# EAGLE design frog (EAGLE 7.5.0)
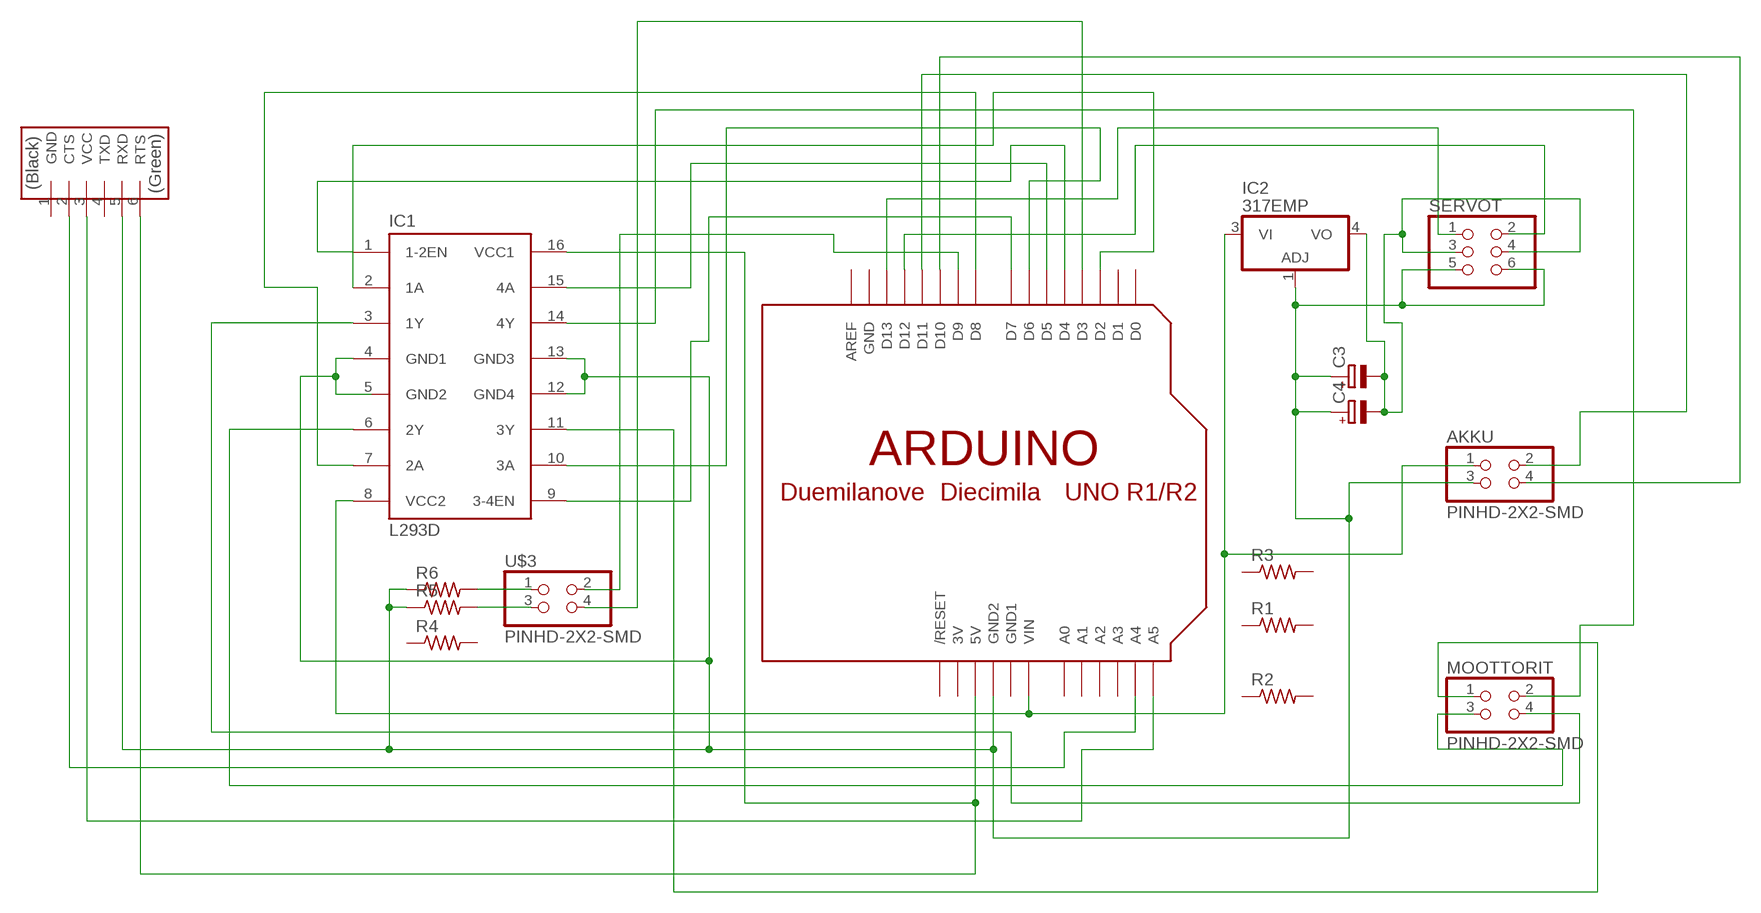
[diagram p0: schematic, sheet 1]

## Parts
AKKU  PINHD-2X2-SMD  [2X02SMD]
C3  CPOL-EUE/7260-38W  [E/7260-38W]
C4  CPOL-EUE/7260-38W  [E/7260-38W]
IC1  L293D  [DIL16]
IC2  317EMP  [SOT223]
MOOTTORIT  PINHD-2X2-SMD  [2X02SMD]
R1  RES-US1206FAB  [R1206FAB]
R2  RES-US1206FAB  [R1206FAB]
R3  RES-US1206FAB  [R1206FAB]
R4  RES-US1206FAB  [R1206FAB]
R5  RES-US1206FAB  [R1206FAB]
R6  RES-US1206FAB  [R1206FAB]
SERVOT  PINHD-2X3-SMD  [2X03SMD]
U$1  ARDUINOUNO  [ARDUINO]
U$2  FTDI-SMD-HEADER  [1X06SMD]
U$3  PINHD-2X2-SMD  [2X02SMD]

## Nets
N$1: IC1.1(1-2EN) U$1.D4
N$2: IC1.2(1A) U$1.D2
N$3: IC1.3(1Y) MOOTTORIT.4
N$4: IC1.6(2Y) MOOTTORIT.3
N$5: IC1.7(2A) U$1.D8
N$6: IC1.14(4Y) MOOTTORIT.2
N$7: AKKU.1 IC1.8(VCC2) IC2.3(VI) U$1.VIN
N$8: IC1.16(VCC1) U$1.5V U$2.6(RTS)
N$9: IC1.15(4A) U$1.D5
N$11: IC1.10(3A) U$1.D6
N$12: C3.- C4.- IC2.4(VO) SERVOT.3 SERVOT.4
N$14: IC1.9(3-4EN) U$1.D7
N$15: AKKU.4 U$1.D10
N$16: U$1.A5 U$2.3(VCC)
N$17: U$1.A4 U$2.2(CTS)
N$18: SERVOT.1 U$1.D13
N$19: SERVOT.2 U$1.D12
N$20: AKKU.2 U$1.D11
N$21: AKKU.3 C3.+ C4.+ IC1.4(GND1) IC1.12(GND4) IC1.13(GND3) IC2.1(ADJ) R5.1 R6.1 SERVOT.5 SERVOT.6 U$1.GND2 U$2.5(RXD)
N$25: IC1.11(3Y) MOOTTORIT.1
N$65: R5.2 U$3.3
N$69: R6.2 U$3.1
N$70: U$1.D9 U$3.2
N$71: U$1.D3 U$3.4
Unconnected: R1.1 R1.2 R2.1 R2.2 R3.1 R3.2 R4.1 R4.2 U$1.A0 U$1.A1 U$1.A2 U$1.A3 U$1.AREF U$1.D0 U$1.D1 U$1.RESET(/RESET) U$2.1(GND) U$2.4(TXD)

## Power pins joined to a net without a drawn wire
3V: U$1.3V
GND: U$1.GND
GND1: U$1.GND1
GND2: IC1.5(GND2)

## Library data of the parts
AKKU MOOTTORIT U$3 = fab:PINHD-2X2-SMD
C3 C4 = rcl:CPOL-EU: POLARIZED CAPACITOR, European symbol
IC1 = st-microelectronics:L293D: PUSH-PULL 4 CHANNEL DRIVER; MPN: L293D; OC_FARNELL: 9589619; OC_NEWARK: 56P8249
IC2 = linear:*317: Positive VOLTAGE REGULATOR
R1-R6 = fab:RES-US: Resistor (US Symbol) Variants with postfix FAB are widened to allow the routing of internal traces
SERVOT = fab:PINHD-2X3-SMD: PIN HEADER
U$1 = adafruit:ARDUINO: Arduino Diecimila/Duemilanove Make a shield with ease, this package has all the named pins as well as the two mounting drill holes and an outline of the USB and DC power connector. The outline is on the DIMENSION layer, so if your board house uses it they will cut the outline to match. http://www.ladyada.net/library/pcb/eaglelibrary.html
U$2 = fab:FTDI-SMD-HEADER

## Board
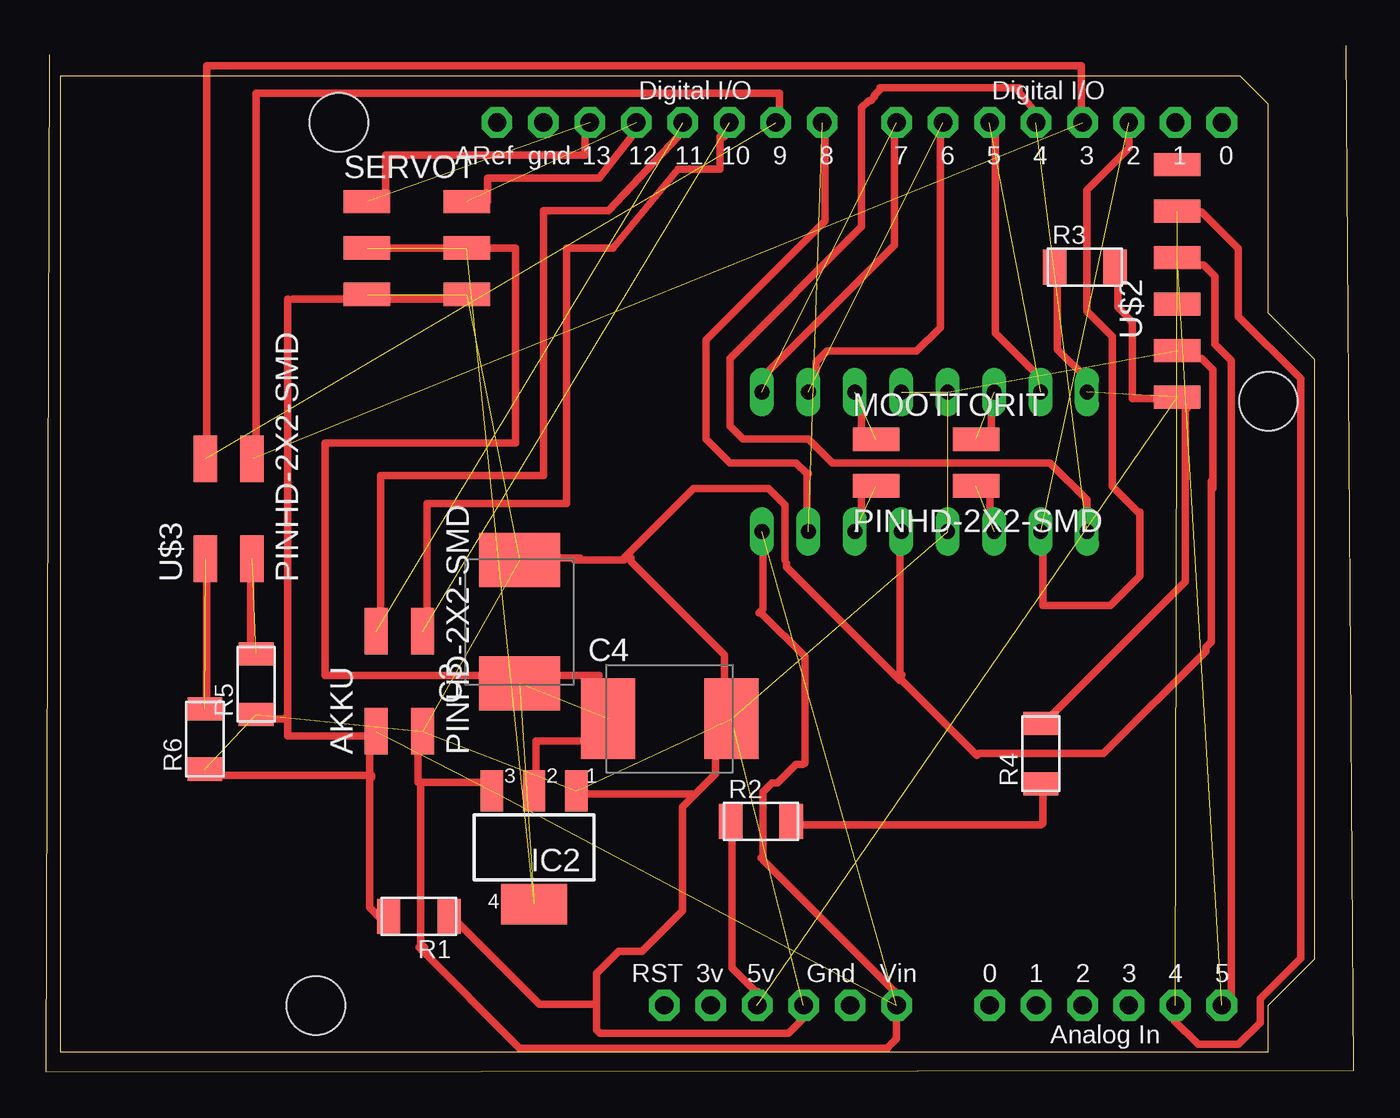
[diagram p1: board, top side]
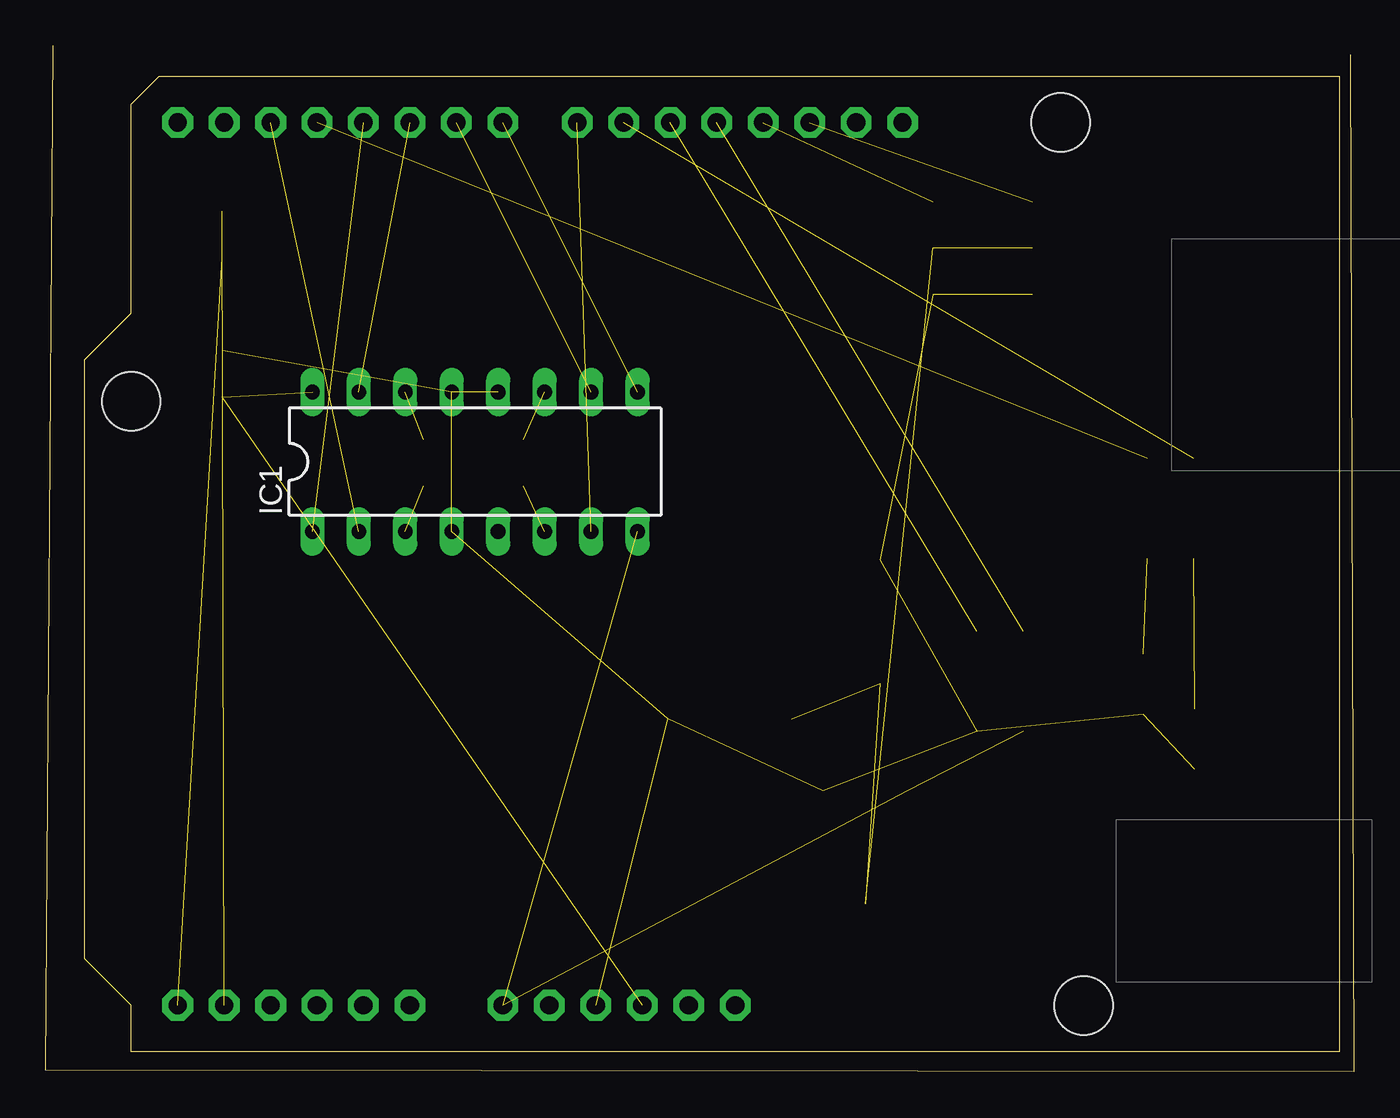
[diagram p2: board, bottom side, seen from below]

Size 71.5 x 56.1 mm. Coordinates in mm from the lower left corner, seen from the top.
Outline: 71.1,56.1 71.5,0.1 0,0 0.2,55.6
Copper layers (1*16): Top 0.035mm / dielectric 1.5mm / Bottom 0.035mm
Design rules "default": minimum track width 10mil, minimum drill 24mil, track to track 8mil, track to pad 8mil, pad to pad 8mil, via to via 8mil, smd to smd 8mil, copper to edge 40mil, drill to drill 8mil, minimum pad ring 10mil, minimum via ring 8mil, stop-mask expansion 4mil, vias tented up to drill 0mil, thermal gap 10mil

### Footprints (pad centres in the part's own frame; a part is rotated, then mirrored left to right if it is on the bottom)
2X02SMD = smd 2.54 x 1.27: 1 -2.54,1.27; 2 2.92,1.27; 3 -2.54,-1.27; 4 2.92,-1.27
E/7260-38W = smd 2.95 x 4.4: + 3.375,0; - -3.375,0
DIL16 = drill 0.813 long: 1 -8.89,-3.81; 2 -6.35,-3.81; 3 -3.81,-3.81; 4 -1.27,-3.81; 5 1.27,-3.81; 6 3.81,-3.81; 7 6.35,-3.81; 8 8.89,-3.81; 9 8.89,3.81; 10 6.35,3.81; 11 3.81,3.81; 12 1.27,3.81; 13 -1.27,3.81; 14 -3.81,3.81; 15 -6.35,3.81; 16 -8.89,3.81
SOT223 = smd 1.219 x 2.235: 1 -2.311,-3.099; 2 0,-3.099; 3 2.311,-3.099 | smd 3.6 x 2.2: 4 0,3.099
R1206FAB = smd 1.27 x 1.905: 1 -1.651,0; 2 1.651,0
2X03SMD = smd 2.54 x 1.27: 1 -2.54,2.54; 2 2.92,2.54; 3 -2.54,0; 4 2.92,0; 5 -2.54,-2.54; 6 2.92,-2.54
ARDUINO = drill 1 pad 1.676 octagon: 3V 35.56,2.54; 5V 38.1,2.54; A0 50.8,2.54; A1 53.34,2.54; A2 55.88,2.54; A3 58.42,2.54; A4 60.96,2.54; A5 63.5,2.54; AREF 23.876,50.8; D0 63.5,50.8; D1 60.96,50.8; D2 58.42,50.8; D3 55.88,50.8; D4 53.34,50.8; D5 50.8,50.8; D6 48.26,50.8; D7 45.72,50.8; D8 41.656,50.8; D9 39.116,50.8; D10 36.576,50.8; D11 34.036,50.8; D12 31.496,50.8; D13 28.956,50.8; GND 26.416,50.8; GND1 43.18,2.54; GND2 40.64,2.54; RESET 33.02,2.54; VIN 45.72,2.54 | hole 3.2: 15.24,50.8; 66.04,35.56; 13.97,2.54
1X06SMD = smd 2.54 x 1.27: 1 0,6.35; 2 0,3.81; 3 0,1.27; 4 0,-1.27; 5 0,-3.81; 6 0,-6.35

### Placement (x,y rotation side)
AKKU  19.33,21.17 90 top
C3  25.9,24.6 90 top
C4  34.1,19.3 0 top
IC1  48.03,33.36 0 bottom
IC2  26.7,12.28 180 top
MOOTTORIT  47.93,33.31 0 top
R1  20.4,8.5 180 top
R2  39.1,13.7 0 top
R3  56.8,44 0 top
R4  54.4,17.4 90 top
R5  11.5,21.2 90 top
R6  8.7,18.2 90 top
SERVOT  20.09,45.04 0 top
U$1  0.79,1.1 0 top
U$2  61.84,43.25 0 top
U$3  10,30.6 90 top

### Tracks (layer width: path | path; a pad name or v marks a point on that pad's centre or on a via)
N$1  (1 unrouted)
N$2  (1 unrouted)
N$3  (1 unrouted)
N$4  (1 unrouted)
N$5  (1 unrouted)
N$6  (1 unrouted)
N$7  (3 unrouted)
N$8  (2 unrouted)
N$9  (1 unrouted)
N$10
  Top 0.406: 44.6,36.2 44.6,35
N$11  (1 unrouted)
N$12  (4 unrouted)
N$13
  Top 0.406: 29.49,51.39 29.49,50.12 18.57,50.12 18.57,47.84
N$14  (1 unrouted)
N$15  (1 unrouted)
N$16  (1 unrouted)
N$17  (1 unrouted)
N$18  (1 unrouted)
N$19  (1 unrouted)
N$20  (1 unrouted)
N$21  (12 unrouted)
N$22
  Top 0.406: 32.03,51.14 30.25,48.85 24.16,48.85 24.16,47.58
N$23
  Top 0.406: 51.7,36 51.7,35
N$24
  Top 0.406: 62.7,39 63.2,39 63.8,38.4 63.8,31.9
N$25  (1 unrouted)
N$26
  Top 0.406: 44.6,31.6 44.6,30.5
N$27
  Top 0.406: 59.7,30.6 58.3,32 58.3,40.2 56.9,41.6 56.9,48.2 59.2,50.5 59.2,51.2
N$28
  Top 0.406: 51.6,31.5 51.6,30.6
N$29
  Top 0.406: 62.3,36.4 62.4,36.3
N$30
  Top 0.406: 51.9,51.4 51.9,40.4 54.3,38
N$31
  Top 0.406: 42.1,38.3 42.1,38.8 42.7,39.4 47.6,39.4 48.9,40.7 48.9,51.2 49,51.3
N$32
  Top 0.406: 37.11,51.14 36.86,51.14 36.86,49.36 34.57,49.36 31.02,45.04 28.48,45.04 28.48,31.07 20.86,31.07 20.86,24.21
N$33
  Top 0.406: 24.41,15.58 24.41,15.83 20.35,15.83 20.35,17.61
N$34
  Top 0.406: 55.3,43.2 55.3,39.5 56.9,37.9
N$35
  Top 0.406: 41.6,30.2 41.6,32.6 41.7,32.7 41.6,32.7 41,33.3 37.4,33.3 36.1,34.6 36.1,40 42.6,46.5 42.6,51.2 42.7,51.3
N$36
  Top 0.406: 39.2,38.2 39.4,38.2 46.4,45.2 46.4,51.6
N$37
  Top 0.406: 18.32,24.47 18.32,32.6 26.44,32.6 26.95,32.6 27.21,32.6 27.21,47.07 30.76,47.07 34.57,51.14
N$38
  Top 0.406: 13.24,42.25 13.24,18.37 17.81,18.37
N$39
  Top 0.406: 28.22,21.67 30.25,21.67
N$40
  Top 0.406: 13.49,42.25 22.89,42.25 22.89,42.5
N$41
  Top 0.406: 18.57,45.04 25.68,45.04 25.68,34.37 15.27,34.37 15.27,21.67 26.95,21.67
N$42
  Top 0.406: 56.9,30.6 56.9,31.3 54.9,33.3 43,33.3 41.7,34.6 38.1,34.6 37.4,35.3 37.4,39 44.6,46.2 44.6,52.7 45,53.1 45.1,53.1 45.3,53.3 45.3,53.4 45.6,53.7
N$43
  Top 0.406: 20.5,15.8 20.5,7 20.7,6.8
N$44
  Top 0.406: 39.2,11.6 46.6,4.2
N$45
  Top 0.406: 40.5,27.8 40.5,27.6 46.7,21.4 46.8,21.4 50.9,17.3
N$46
  Top 0.406: 20.4,6.8 25.9,1.3 46,1.3 46.1,1.4
N$47
  Top 0.406: 32,28.1 32,27.9 37.1,22.8 37.1,21
N$48
  Top 0.406: 40.4,28 40.4,31 39.5,31.9 35.4,31.9 31.6,28.1
N$49
  Top 0.406: 46.7,28.7 46.7,21.8 46.8,21.7
N$50
  Top 0.406: 46.5,2.8 46.5,1.8 46.2,1.5
N$51
  Top 0.406: 31.6,28 28.9,28
N$52
  Top 0.406: 17.7,17.8 17.7,9 18.4,8.3
N$53
  Top 0.406: 22.4,8.4 22.4,8.3 27,3.7 30,3.7
N$54
  Top 0.406: 37.5,13 37.5,5.7 38.8,4.4 38.9,4.4
N$55
  Top 0.406: 58.6,43.2 58.6,41.8 59.4,41 59.4,36.8 60.8,36.8
N$56
  Top 0.406: 62.6,44.1 63.3,44.1 63.9,43.5 63.9,39.8 64.8,38.9 64.8,4
N$57
  Top 0.406: 51,17.4 57.8,17.4 63.4,23 63.4,23.2 63.7,23.5 63.7,32.3
N$58
  Top 0.406: 62.7,47 63.2,47 65.2,45 65.2,41.3 68.6,37.9 68.6,6.2 66.4,4 66.4,2.7 65.2,1.5 63,1.5 61.7,2.8
N$59
  Top 0.406: 59.8,30.6 59.8,27.1 58.2,25.5 54.5,25.5 54.5,28.7
N$60
  Top 0.406: 62.3,36.5 62.3,26.8 54.6,19.1
N$61
  Top 0.406: 40.8,13.5 54.4,13.5 54.5,13.6 54.5,15.5 54.4,15.6
N$62
  Top 0.406: 39.2,28.6 39.2,25.3 39,25.1 39.1,25.1 41.5,22.7 41.5,16.9 41.4,16.8 41,16.8 40,15.8 39.7,15.8 39.2,15.3 39.2,11.8 39.1,11.7
N$63
  Top 0.406: 28,28.1 29.2,28.1
N$64
  Top 0.406: 41.4,2.9 40.6,2.1 30.3,2.1 30.1,2.3 30.1,5.4 31.3,6.6 32.6,6.6 34.8,8.8 34.8,9
N$65  (1 unrouted)
N$66
  Top 0.406: 36.6,17.3 36.6,16.3 34.8,14.5 34.8,9.1
N$67
  Top 0.406: 26.8,16.5 26.8,18.1 30.2,18.1
N$68
  Top 0.406: 29.4,15.2 35.3,15.2 35.3,15.1
N$69  (1 unrouted)
N$70  (1 unrouted)
N$71  (1 unrouted)
N$72
  Top 0.406: 45.6,53.8 53.2,53.8 53.2,53.6 54.1,52.5
N$73
  Top 0.406: 56.7,52.4 56.6,52.4 56.6,55 8.8,55 8.8,33.1
N$74
  Top 0.406: 40.2,52.2 40.1,52.2 40.1,53.5 11.5,53.5 11.5,33.6 11.7,33.6 11.7,33.3
N$75
  Top 0.406: 8.9,27.6 8.8,27.6 8.8,20
N$76
  Top 0.406: 11.3,27.2 11.2,27.2 11.2,22.6
N$77
  Top 0.406: 12.2,19.3 13.2,19.3 13.2,19.5
N$78
  Top 0.406: 9.2,16.2 17.8,16.2 17.8,16.1